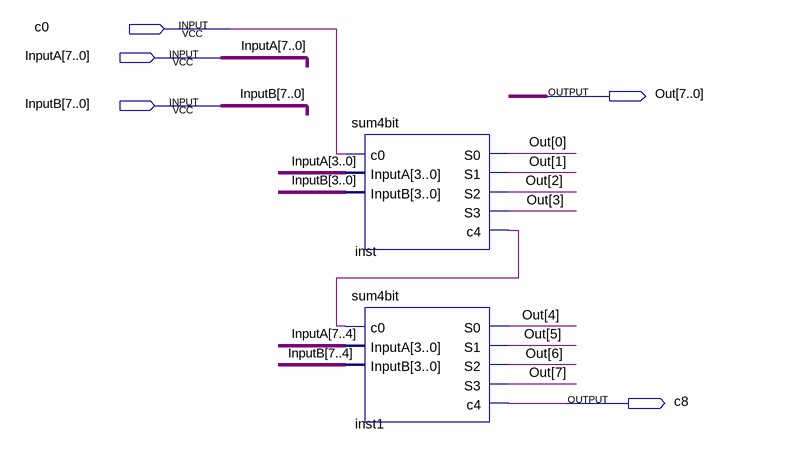
[diagram p0: schematic sheet]
// Quartus schematic Lab2_1.bdf as structural Verilog: 2 symbols, 5 pins
module Lab2_1 (
  input  c0,
  input  [7:0] InputA,
  input  [7:0] InputB,
  output [7:0] Out,
  output c8
);

  wire inst_c4;

  sum4bit inst (
    .c0(c0), .InputA(InputA[3:0]), .InputB(InputB[3:0]), .S0(Out[0]), .S1(Out[1]), .S2(Out[2]), .S3(Out[3]),
    .c4(inst_c4));
  sum4bit inst1 (
    .c0(inst_c4), .InputA(InputA[7:4]), .InputB(InputB[7:4]), .S0(Out[4]), .S1(Out[5]), .S2(Out[6]),
    .S3(Out[7]), .c4(c8));
endmodule
